# Altium schematic sheet TWindow.schDoc
size B; Organization: Altium Limited; Address1: L3, 12a Rodborough Rd; Address2: Frenchs Forest; Address3: NSW; Address4: Australia 2086; DocumentNumber: 2; SheetNumber: 2; SheetTotal: 3
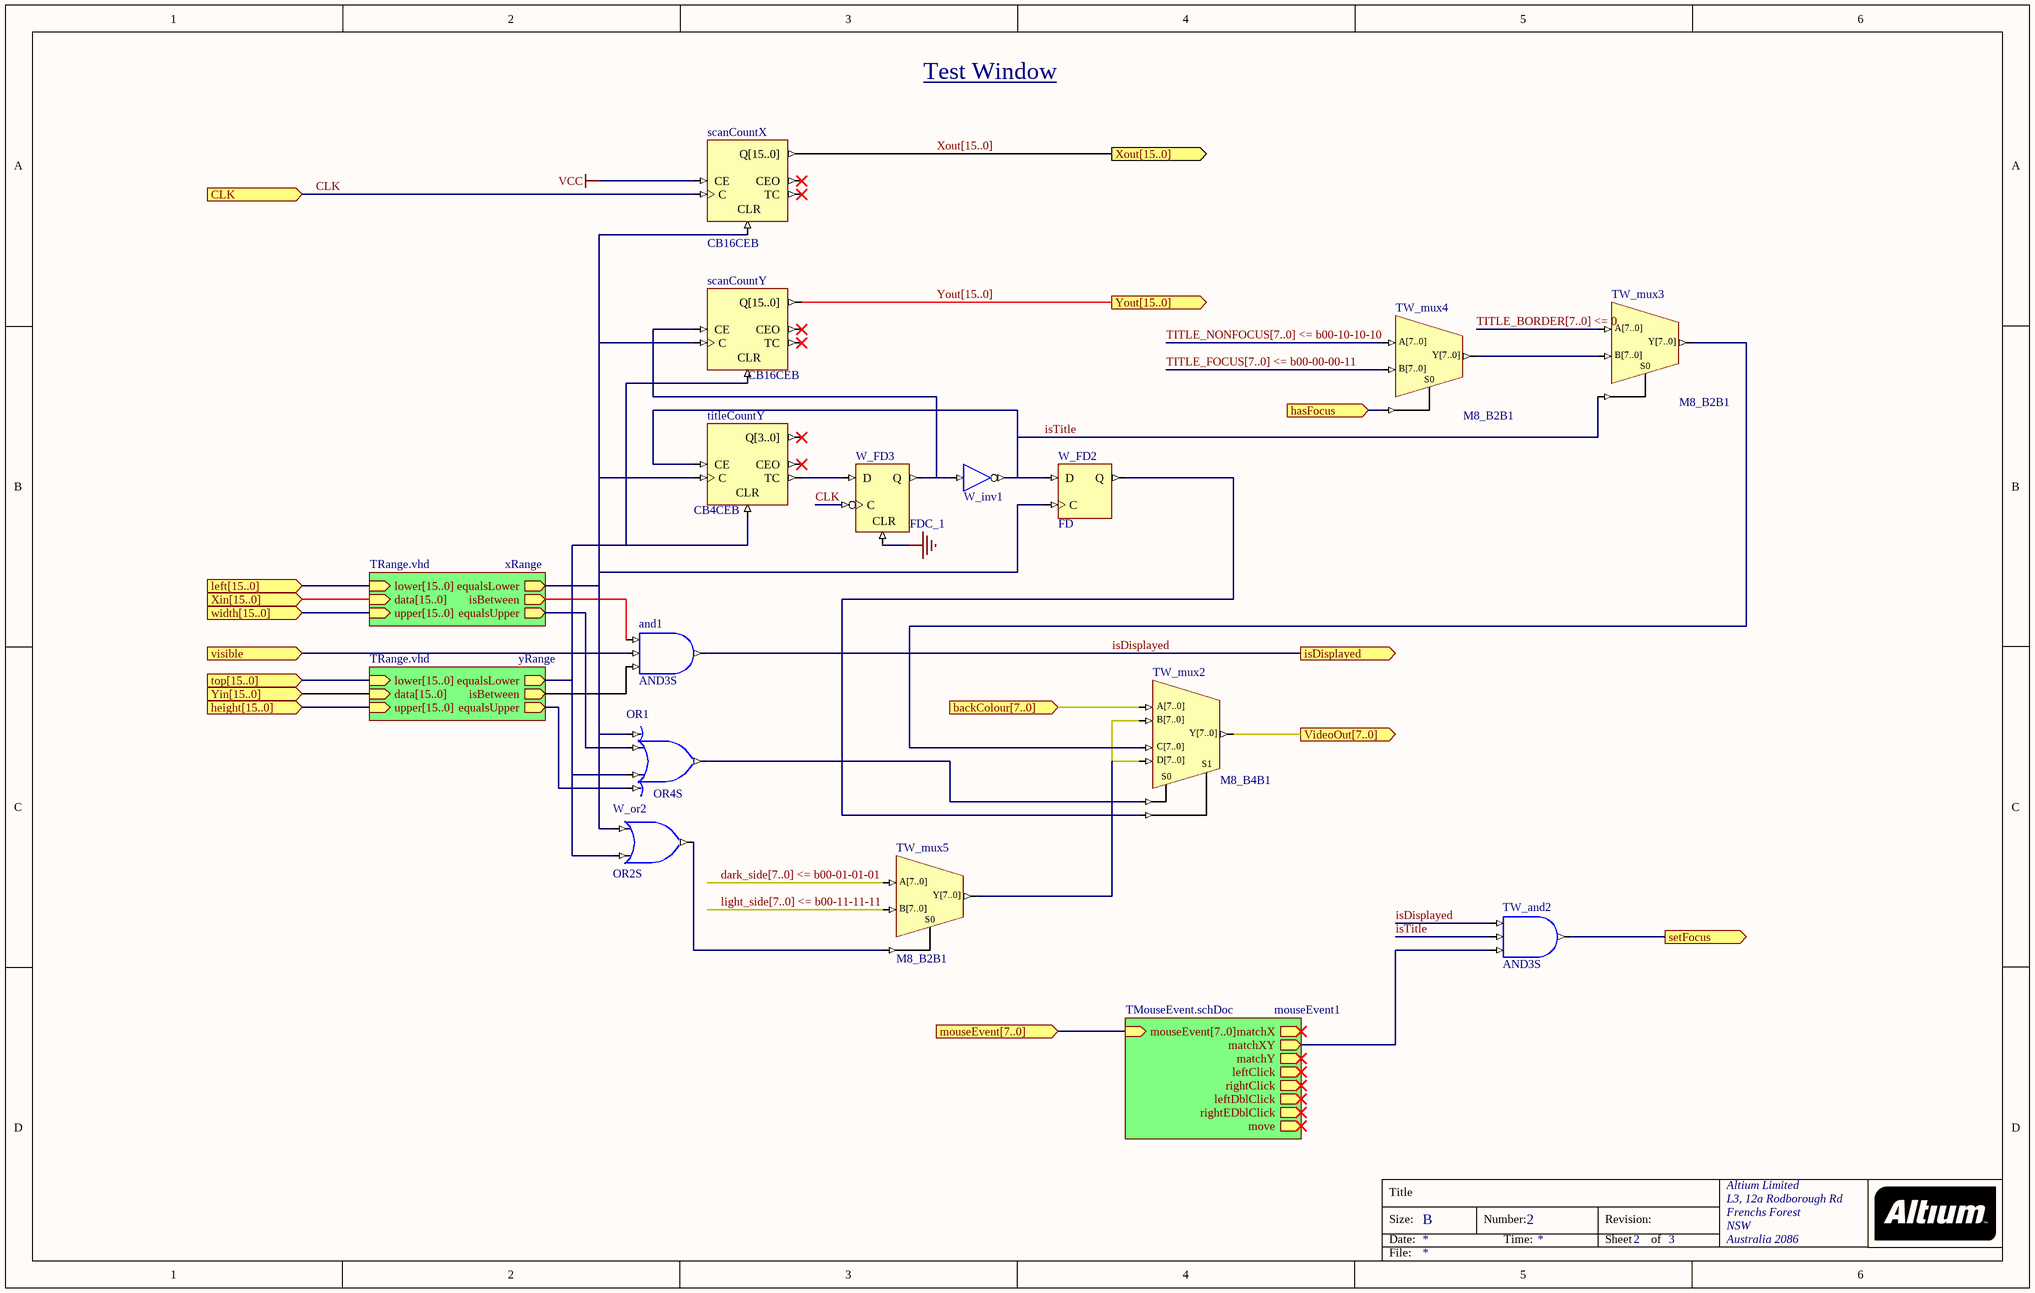
[diagram p0: TWindow.schDoc]

## Parts
and1  AND3S
OR1  OR4S
scanCountX  CB16CEB
scanCountY  CB16CEB
titleCountY  CB4CEB
TW_and2  AND3S
TW_mux2  M8_B4B1
TW_mux3  M8_B2B1
TW_mux4  M8_B2B1
TW_mux5  M8_B2B1
W_FD2  FD
W_FD3  FDC_1
W_inv1  INV  (value not drawn)
W_or2  OR2S

## Sub-sheets
mouseEvent1 = TMouseEvent.schDoc: mouseEvent[7..0] (in), matchX (out), matchXY (out), matchY (out), leftClick (out), rightClick (out), leftDblClick (out), rightEDblClick (out), move (out)
xRange = TRange.vhd: lower[15..0] (in), data[15..0] (in), upper[15..0] (in), isBetween (out), equalsLower (out), equalsUpper (out)
yRange = TRange.vhd: lower[15..0] (in), data[15..0] (in), upper[15..0] (in), isBetween (out), equalsLower (out), equalsUpper (out)

## Ports
backColour[7..0] (in), CLK (in), hasFocus (in), height[15..0] (in), isDisplayed (out), left[15..0] (in), mouseEvent[7..0] (in), setFocus (out), top[15..0] (in), VideoOut[7..0] (out), visible (in), width[15..0] (in), Xin[15..0] (in), Xout[15..0] (out), Yin[15..0] (in), Yout[15..0] (out)

## Nets
GND: W_FD3.CLR
VCC: scanCountX.CE
backColour[7..0]: TW_mux2.A[7..0] ; port backColour[7..0]
CLK: scanCountX.C W_FD3.C ; port CLK
dark_side[7..0] <= b00-01-01-01: TW_mux5.A[7..0]
hasFocus: TW_mux4.S0 ; port hasFocus
isDisplayed: and1.O TW_and2.I0 ; port isDisplayed
isTitle: titleCountY.CE TW_and2.I1 TW_mux3.S0 W_FD2.D W_inv1.O
light_side[7..0] <= b00-11-11-11: TW_mux5.B[7..0]
setFocus: TW_and2.O ; port setFocus
TITLE_BORDER[7..0] <= 0: TW_mux3.A[7..0]
TITLE_FOCUS[7..0] <= b00-00-00-11: TW_mux4.B[7..0]
TITLE_NONFOCUS[7..0] <= b00-10-10-10: TW_mux4.A[7..0]
VideoOut[7..0]: TW_mux2.Y[7..0] ; port VideoOut[7..0]
visible: and1.I1 ; port visible
Xout[15..0]: scanCountX.Q[15..0] ; port Xout[15..0]
Yout[15..0]: scanCountY.Q[15..0] ; port Yout[15..0]
Netand1_I0: and1.I0 ; sheet xRange/isBetween
Netand1_I2: and1.I2 ; sheet yRange/isBetween
NetOR1_I0: OR1.I0 scanCountX.CLR scanCountY.C titleCountY.C W_FD2.C W_or2.I0 ; sheet xRange/equalsLower
NetOR1_I1: OR1.I1 ; sheet xRange/equalsUpper
NetOR1_I2: OR1.I2 scanCountY.CLR titleCountY.CLR W_or2.I1 ; sheet yRange/equalsLower
NetOR1_I3: OR1.I3 ; sheet yRange/equalsUpper
NetOR1_O: OR1.O TW_mux2.S0
NetscanCountY_CE: scanCountY.CE W_FD3.Q W_inv1.I
NettitleCountY_TC: titleCountY.TC W_FD3.D
NetTW_and2_I2: TW_and2.I2 ; sheet mouseEvent1/matchXY
NetTW_mux2_B[7..0]: TW_mux2.B[7..0] TW_mux2.D[7..0] TW_mux5.Y[7..0]
NetTW_mux2_C[7..0]: TW_mux2.C[7..0] TW_mux3.Y[7..0]
NetTW_mux2_S1: TW_mux2.S1 W_FD2.Q
NetTW_mux3_B[7..0]: TW_mux3.B[7..0] TW_mux4.Y[7..0]
NetTW_mux5_S0: TW_mux5.S0 W_or2.O

Not connected (* = marked no-connect by the designer): scanCountX CEO* TC*; scanCountY CEO* TC*; titleCountY CEO* Q[3..0]*

## Buses and harness runs
bus dark_side[7..0] <= b00-01-01-01
bus light_side[7..0] <= b00-11-11-11
bus port height[15..0] = sheet yRange/upper[15..0]
bus port left[15..0] = sheet xRange/lower[15..0]
bus port mouseEvent[7..0] = sheet mouseEvent1/mouseEvent[7..0]
bus port top[15..0] = sheet yRange/lower[15..0]
bus port width[15..0] = sheet xRange/upper[15..0]
bus port Xin[15..0] = sheet xRange/data[15..0]
bus port Yin[15..0] = sheet yRange/data[15..0]
bus TITLE_BORDER[7..0] <= 0
bus TITLE_FOCUS[7..0] <= b00-00-00-11
bus TITLE_NONFOCUS[7..0] <= b00-10-10-10
bus Xout[15..0] = port Xout[15..0]
bus Yout[15..0] = port Yout[15..0]

## Notes on the sheet
- Test Window
- Title
- Size:
- Date:
- B
- Number:
- Time:
- Revision:
- Sheet
- of
- File:

## Library data of the parts
and1 TW_and2 = AND3S: 3-Input AND Gate, Single Pin Version; Xilinx Equivalent: AND3; ArchiveName: GENERIC; VHDLIB_SIM: GENERIC_LIB; Published: 28-Jan-2004; Publisher: Altium Limited; Core Revision: 1.00.00
OR1 = OR4S: 4-Input OR Gate, Single Pin Version; Xilinx Equivalent: OR4; ArchiveName: GENERIC; VHDLIB_SIM: GENERIC_LIB; Published: 28-Jan-2004; Publisher: Altium Limited; Core Revision: 1.00.00
scanCountX scanCountY = CB16CEB: 16-Bit Cascadable Binary Counters with Clock Enable and Asynchronous Clear, Bus Version; Xilinx Equivalent: CB16CE; ArchiveName: GENERIC; VHDLIB_SIM: GENERIC_LIB; Published: 28-Jan-2004; Publisher: Altium Limited; Core Revision: 1.00.00
titleCountY = CB4CEB: 4-Bit Cascadable Binary Counters with Clock Enable and Asynchronous Clear, Bus Version; ArchiveName: GENERIC; VHDLIB_SIM: GENERIC_LIB; Published: 28-Jan-2004; Publisher: Altium Limited; Core Revision: 1.00.00
TW_mux2 = M8_B4B1: 4x8-Bit Bus to 1x8-Bit Bus Multiplexer; ArchiveName: GENERIC; VHDLIB_SIM: GENERIC_LIB; Published: 28-Jan-2004; Publisher: Altium Limited; Core Revision: 1.00.00
TW_mux3-TW_mux5 = M8_B2B1: 2x8-Bit Bus to 1x8-Bit Bus Multiplexer; ArchiveName: GENERIC; VHDLIB_SIM: GENERIC_LIB; Published: 28-Jan-2004; Publisher: Altium Limited; Core Revision: 1.00.00
W_FD2 = FD: D-Type Flip-Flop; ArchiveName: GENERIC; VHDLIB_SIM: GENERIC_LIB; Published: 28-Jan-2004; Publisher: Altium Limited; Xilinx Equivalent: FD; Core Revision: 1.00.00
W_FD3 = FDC_1: D-Type Negative Edge Flip-Flop with Asynchronous Clear; ArchiveName: GENERIC; VHDLIB_SIM: GENERIC_LIB; Published: 28-Jan-2004; Publisher: Altium Limited; Xilinx Equivalent: FDC_1; Core Revision: 1.00.00
W_inv1 = INV: Inverter; ArchiveName: GENERIC; VHDLIB_SIM: GENERIC_LIB; Published: 28-Jan-2004; Publisher: Altium Limited; Xilinx Equivalent: INV; Core Revision: 1.00.00
W_or2 = OR2S: 2-Input OR Gate, Single Pin Version; Xilinx Equivalent: OR2; ArchiveName: GENERIC; VHDLIB_SIM: GENERIC_LIB; Published: 28-Jan-2004; Publisher: Altium Limited; Core Revision: 1.00.00